# Altium schematic sheet Mini58FDE_nRF24L01_Master.SchDoc
size A4; SheetNumber: 1; SheetTotal: 1
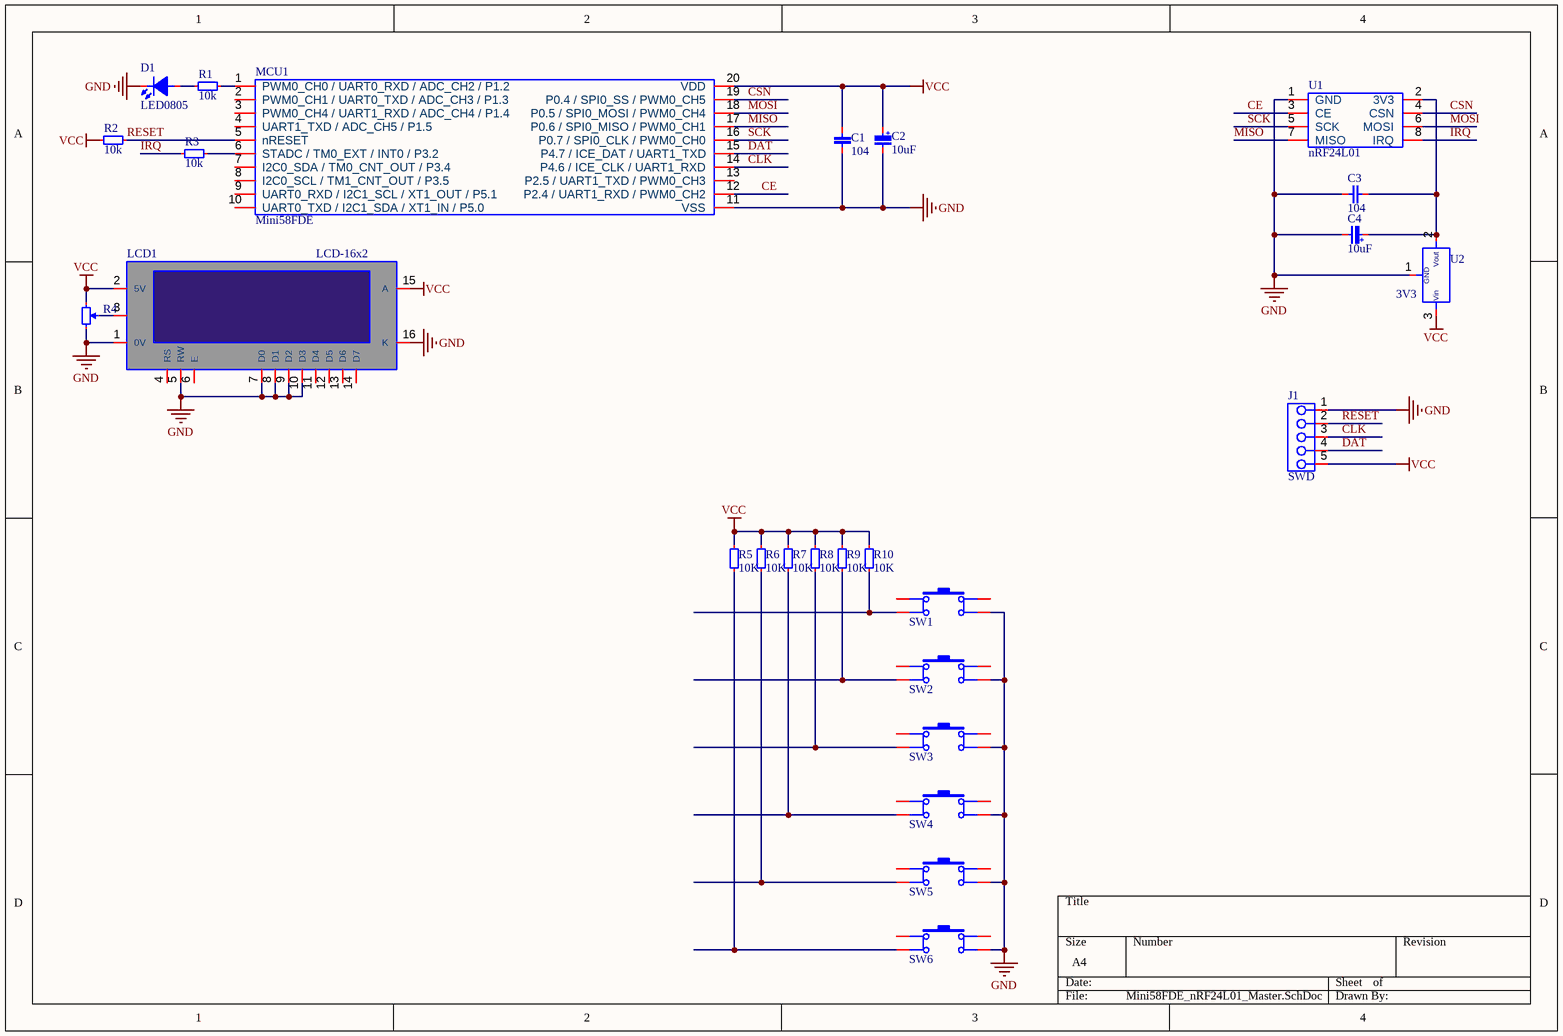
[diagram p0: Mini58FDE_nRF24L01_Master.SchDoc]

## Parts
C1  104  [C0805]
C2  10uF  [CAP_RAD_D05x11]
C3  104  [C1206]
C4  10uF  [CAP_RAD_D05x11]
D1  LED0805  [L0805RED]
J1  SWD  [HEADER-MALE-05PINS-2.54MM]
LCD1  LCD-16x2  [LCD-16x2-VIOLET]
MCU1  Mini58FDE  [TSSOP20_0.65_4.4]
R1  10k  [R0805]
R2  10k  [R0805]
R3  10k  [R0805]
R4  Trimpot  [Trimpot 3296W]  (value not drawn)
R5  10K  [RES-0.25W-H]
R6  10K  [RES-0.25W-H]
R7  10K  [RES-0.25W-H]
R8  10K  [RES-0.25W-H]
R9  10K  [RES-0.25W-H]
R10  10K  [RES-0.25W-H]
SW1  Button Hole  [BUTTON_HOLE_4.3mm]  (value not drawn)
SW2  Button Hole  [BUTTON_HOLE_4.3mm]  (value not drawn)
SW3  Button Hole  [BUTTON_HOLE_4.3mm]  (value not drawn)
SW4  Button Hole  [BUTTON_HOLE_4.3mm]  (value not drawn)
SW5  Button Hole  [BUTTON_HOLE_4.3mm]  (value not drawn)
SW6  Button Hole  [BUTTON_HOLE_4.3mm]  (value not drawn)
U1  nRF24L01  [nRF24L01]
U2  3V3  [SOT223-3]

## Nets
GND: C1.1 C2.2 C3.1 C4.2 D1.2(K) J1.1 LCD1.1(0V) LCD1.5(RW) LCD1.7(D0) LCD1.8(D1) LCD1.9(D2) LCD1.10(D3) LCD1.16(K) MCU1.11(VSS) R4.3(-) SW1.4 SW2.4 SW3.4 SW4.4 SW5.4 SW6.4 U1.1(GND) U2.1
VCC: C1.2 C2.1 J1.5 LCD1.2(5V) LCD1.15(A) MCU1.20(VDD) R2.2 R4.1(+) R5.2 R6.2 R7.2 R8.2 R9.2 R10.2 U2.3
CE: MCU1.12(P2.4_/_UART1_RXD_/_PWM0_CH2) U1.3(CE)
CLK: J1.3 MCU1.14(P4.6_/_ICE_CLK_/_UART1_RXD)
CSN: MCU1.19(P0.4_/_SPI0_SS_/_PWM0_CH5) U1.4(CSN)
DAT: J1.4 MCU1.15(P4.7_/_ICE_DAT_/_UART1_TXD)
IRQ: R3.1 U1.8(IRQ)
MISO: MCU1.17(P0.6_/_SPI0_MISO_/_PWM0_CH1) U1.7(MISO)
MOSI: MCU1.18(P0.5_/_SPI0_MOSI_/_PWM0_CH4) U1.6(MOSI)
RESET: J1.2 MCU1.5(nRESET) R2.1
SCK: MCU1.16(P0.7_/_SPI0_CLK_/_PWM0_CH0) U1.5(SCK)
NetC3_2: C3.2 C4.1 U1.2(3V3) U2.2
NetD1_1: D1.1(A) R1.1
NetLCD1_3: LCD1.3(VEE) R4.2(W)
NetMCU1_1: MCU1.1(PWM0_CH0_/_UART0_RXD_/_ADC_CH2_/_P1.2) R1.2
NetMCU1_6: MCU1.6(STADC_/_TM0_EXT_/_INT0_/_P3.2) R3.2
NetR5_1: R5.1 SW6.2
NetR6_1: R6.1 SW5.2
NetR7_1: R7.1 SW4.2
NetR8_1: R8.1 SW3.2
NetR9_1: R9.1 SW2.2
NetR10_1: R10.1 SW1.2

Not connected (* = marked no-connect by the designer): LCD1 4(RS) 6(E) 11(D4) 12(D5) 13(D6) 14(D7); MCU1 2(PWM0_CH1_/_UART0_TXD_/_ADC_CH3_/_P1.3) 3(PWM0_CH4_/_UART1_RXD_/_ADC_CH4_/_P1.4) 4(UART1_TXD_/_ADC_CH5_/_P1.5) 7(I2C0_SDA_/_TM0_CNT_OUT_/_P3.4) 8(I2C0_SCL_/_TM1_CNT_OUT_/_P3.5) 9(UART0_RXD_/_I2C1_SCL_/_XT1_OUT_/_P5.1) 10(UART0_TXD_/_I2C1_SDA_/_XT1_IN_/_P5.0) 13(P2.5_/_UART1_TXD_/_PWM0_CH3); SW1 1 3; SW2 1 3; SW3 1 3; SW4 1 3; SW5 1 3; SW6 1 3

## Notes on the sheet
- (in symbol Capacitor(Radian)) +
- (in symbol Ic-AMS1117(SOT-223)) Vout; GND; Vin

## Library data of the parts
C1 C3 = Capacitors(SMD)
C2 C4 = Capacitor(Radian)
J1 = HEADER-MALE-05PINS-2.54MM
LCD1 = LCD-16x2-Violet
MCU1 = Mcu-Mini58FDE: Novoton 4Kb-RAM 32Kb-Flash
R1-R3 = Resistors-SMD
R4 = ResTrimpot
R5-R10 = Resistors THD
U1 = Module-nRF24L01
U2 = Ic-AMS1117(SOT-223)